# Altium project TP_IHM.PrjPCB
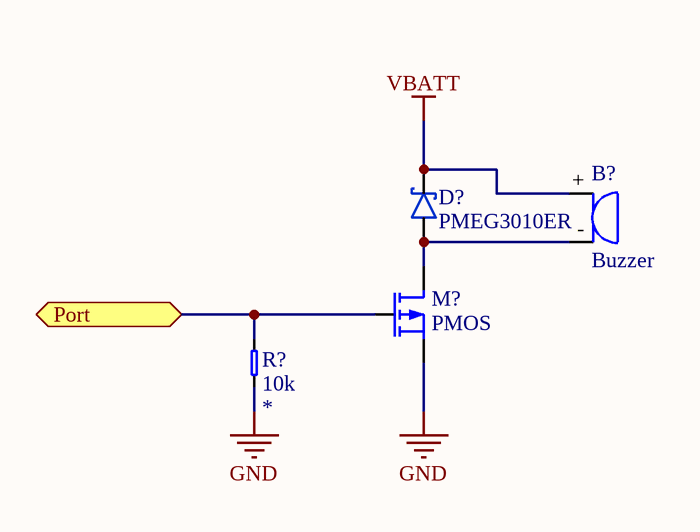
[diagram p0: TP_IHM_BUZZER.SchDoc]
5 sheets, 24 parts. Net scope: flat (ports and power ports of the same name join across sheets).
Sheets:
  TP_IHM_BUZZER.SchDoc
  TP_IHM_7SEG.SchDoc
  TP_IHM_POWER.SchDoc
  TP_IHM_CONNECTOR.SchDoc
  TP_IHM_7SEG_DRIVERS.SchDoc

## Sheet TP_IHM_BUZZER.SchDoc
size A4

### Parts
(Parts that share a designator on the sheet are numbered #1, #2 ... from top to bottom, then left to right.)
B?  Buzzer  [SD160709]
D?#1  PMEG3010ER  [SOD123W]
M?  PMOS  [MOSFET-SOT23]
R?#1  value 10k  [0402_RES_LD]  (hidden comment: Resistor)

### Ports
Port

### Nets
GND: M?.S R?#1.1
VBATT: B?.+ D?#1.K
NetB?_-: B?.- D?#1.A M?.D
NetC?#2_1: M?.G R?#1.2 ; port Port

### Library data of the parts
B? = SD160709: TDK SD160709 Buzzer; Reference: SD160709
D?#1 = Schottky_PMEG3010ER: Nexperia 1A low Vf Mega Schottky barrier rectifier; Reference: PMEG3010ER
M? = P-MOSFET: P MOSFET
R?#1 = Resistor: Precision: *; Package: *

## Sheet TP_IHM_7SEG.SchDoc
size A4
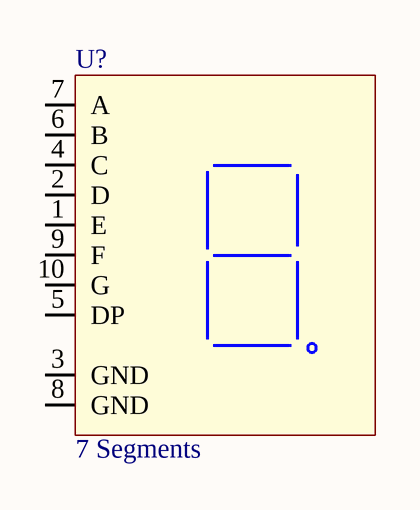
[diagram p1: TP_IHM_7SEG.SchDoc]

### Parts
U?  7 Segments  [SA10-21GWA]

### Nets

Not connected (* = marked no-connect by the designer): U? 1(E) 2(D) 3(GND) 4(C) 5(DP) 6(B) 7(A) 8(GND) 9(F) 10(G)

### Library data of the parts
U? = SC10-21SRWA: KingBright Led 7 Segments; Reference: SC10-21SRWA

## Sheet TP_IHM_POWER.SchDoc
size A4
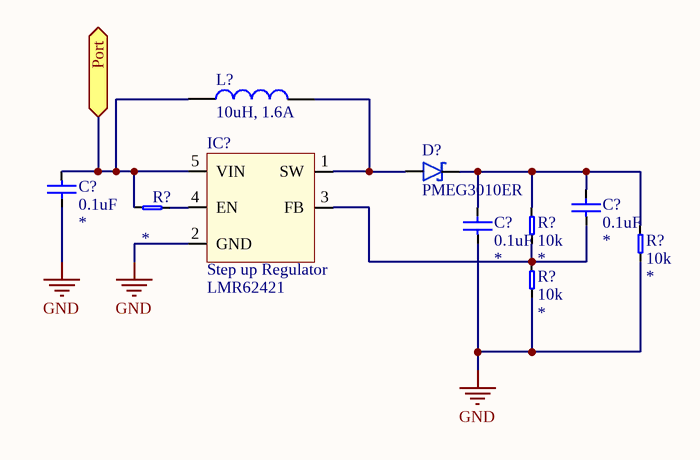
[diagram p2: TP_IHM_POWER.SchDoc]

### Parts
(Parts that share a designator on the sheet are numbered #1, #2 ... from top to bottom, then left to right.)
C?#1  value 0.1uF  [0402_CAP_LD]  (hidden comment: CerCap)
C?#2  value 0.1uF  [0402_CAP_LD]  (hidden comment: CerCap)
C?#3  value 0.1uF  [0402_CAP_LD]  (hidden comment: CerCap)
D?#2  PMEG3010ER  [SOD123W]
IC?#1  Step up Regulator  [LMR62421]
L?  10uH, 1.6A  [INDUCTOR_WE-LQS_5020]
R?#2  Resistor  [0402_RES_LD]  (value not drawn)
R?#3  value 10k  [0402_RES_LD]  (hidden comment: Resistor)
R?#4  value 10k  [0402_RES_LD]  (hidden comment: Resistor)
R?#5  value 10k  [0402_RES_LD]  (hidden comment: Resistor)

### Ports
Port

### Nets
GND: C?#2.2 C?#3.1 IC?#1.2(GND) R?#4.1 R?#5.1
NetC?#1_1: C?#1.1 IC?#1.3(FB) R?#3.1 R?#5.2
NetC?#1_2: C?#1.2 C?#3.2 D?#2.K R?#3.2 R?#4.2
NetC?#2_1: C?#2.1 IC?#1.5(VIN) L?.1 R?#2.1 ; port Port
NetD?#2_A: D?#2.A IC?#1.1(SW) L?.2
NetIC?#1_4: IC?#1.4(EN) R?#2.2

### Library data of the parts
C?#1-C?#3 = CerCap: Ceramic Capacitor; Type: *; Voltage/Power: *; Package: *
D?#2 = Schottky_PMEG3010ER: as D?#1 on sheet TP_IHM_BUZZER; Reference: PMEG3010ER
IC?#1 = LMR62421XMF: LMR62421 simple switcher 24 Vout stepup voltage SOT-23; Reference: LMR62421
L? = INDUCTOR_74404052100: WE-LQS SMD Power Inductor, size 5020, 10uH, 1.6A; DC Resistance: 109mOhm; Inductance Tolerance: +/-20%; Saturation Current: 1.95A; Self Resonant Frequency: 37MHz; ComponentLink1Description: Manufacturer; ComponentLink1URL: http://www.we-online.de; ComponentLink2Description: Datasheet; ComponentLink2URL: https://katalog.we-online.com/pbs/datasheet/74404052100.pdf; Part Number: 74404052100; Published Date: May 2019; Publisher: Wurth Elektronik; Rated Current: 1.6A; Inductance: 10uH; Operating Temperature: -40 to +125degC; Mounting Technology: SMT; Packaging: Tape and Reel; DC Resistance Tolerance: +/-20%; Size: 5020; Reference: 74404052100
R?#2-R?#5 = Resistor: Precision: *; Package: *

## Sheet TP_IHM_CONNECTOR.SchDoc
size A4
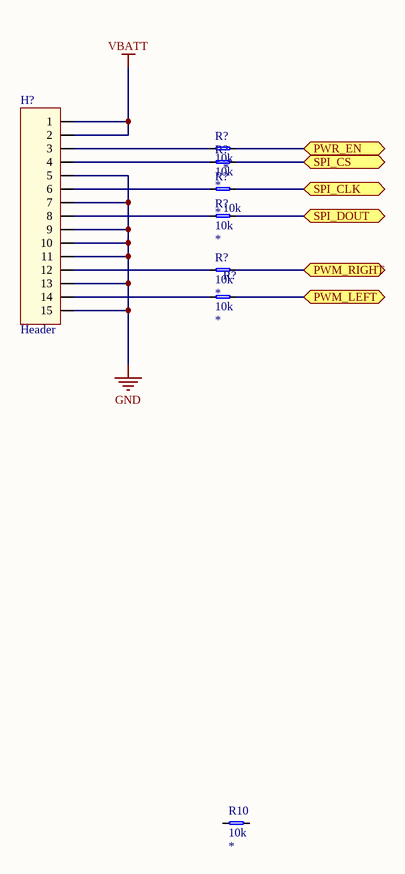
[diagram p3: TP_IHM_CONNECTOR.SchDoc]

### Parts
(Parts that share a designator on the sheet are numbered #1, #2 ... from top to bottom, then left to right.)
H?  Header  [653115131822]
R10  value 10k  [0402_RES_LD]  (hidden comment: Resistor)
R?#6  value 10k  [0402_RES_LD]  (hidden comment: Resistor)
R?#7  value 10k  [0402_RES_LD]  (hidden comment: Resistor)
R?#8  value 10k  [0402_RES_LD]  (hidden comment: Resistor)
R?#9  value 10k  [0402_RES_LD]  (hidden comment: Resistor)
R?#10  value 10k  [0402_RES_LD]  (hidden comment: Resistor)
R?#11  value 10k  [0402_RES_LD]  (hidden comment: Resistor)

### Ports
PWM_LEFT, PWM_RIGHT, PWR_EN, SPI_CLK, SPI_CS, SPI_DOUT

### Nets
GND: H?.5 H?.7 H?.9 H?.10 H?.11 H?.13 H?.15
VBATT: H?.1 H?.2
NetH?_3: H?.3 R?#6.1
NetH?_4: H?.4 R?#7.1
NetH?_6: H?.6 R?#8.1
NetH?_8: H?.8 R?#9.1
NetH?_12: H?.12 R?#10.1
NetH?_14: H?.14 R?#11.1
NetR?#6_2: R?#6.2 ; port PWR_EN
NetR?#7_2: R?#7.2 ; port SPI_CS
NetR?#8_2: R?#8.2 ; port SPI_CLK
NetR?#9_2: R?#9.2 ; port SPI_DOUT
NetR?#10_2: R?#10.2 ; port PWM_RIGHT
NetR?#11_2: R?#11.2 ; port PWM_LEFT

Not connected (* = marked no-connect by the designer): R10 1 2

### Library data of the parts
H? = HEADER_15x1: Header 15x1
R10 R?#6-R?#11 = Resistor: Precision: *; Package: *

## Sheet TP_IHM_7SEG_DRIVERS.SchDoc
size A4
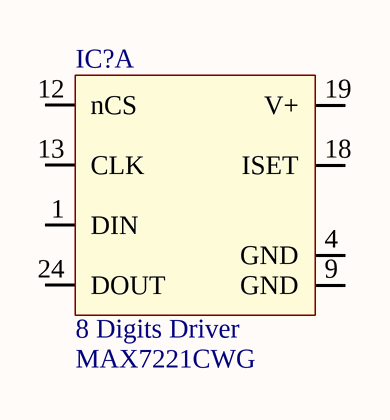
[diagram p4: TP_IHM_7SEG_DRIVERS.SchDoc]

### Parts
(Parts that share a designator on the sheet are numbered #1, #2 ... from top to bottom, then left to right.)
IC?#2  8 Digits Driver  [MAX7221CWG]  (part A of 3)

### Nets

Not connected (* = marked no-connect by the designer): IC?#2 1(DIN) 4(GND) 9(GND) 12(nCS) 13(CLK) 18(ISET) 19(V+) 24(DOUT)

### Library data of the parts
IC?#2 = MAX7221: MAX7221 8 Digit 7 Segments Display; Reference: MAX7221CWG

## Nets that join several sheets
GND: TP_IHM_BUZZER (M?.S R?#1.1), TP_IHM_POWER (5 pins), TP_IHM_CONNECTOR (7 pins)
VBATT: TP_IHM_BUZZER (B?.+ D?#1.K), TP_IHM_CONNECTOR (H?.1 H?.2)
NetC?#2_1: TP_IHM_BUZZER (M?.G R?#1.2), TP_IHM_POWER (C?#2.1 IC?#1.5 L?.1 R?#2.1)